# Altium project wired.PrjPcb
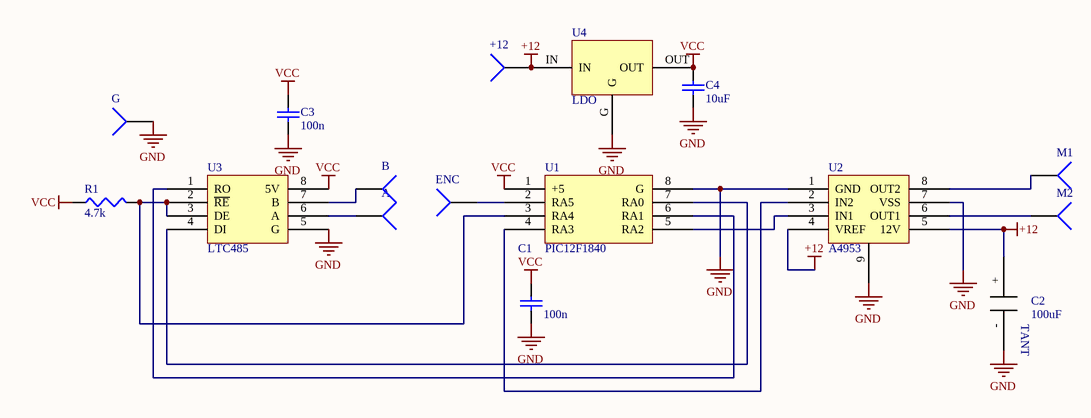
[diagram p0: bluenrg.SchDoc]
1 sheet, 16 parts. Net scope: global (net labels, ports and power ports of the same name join across sheets).
Board file: wired.PcbDoc

## Sheet bluenrg.SchDoc
size A3

### Parts
+12  +12  [MY_PAD]  (value not drawn)
A  A  [MY_PAD]  (value not drawn)
B  B  [MY_PAD]  (value not drawn)
C1  100n  [MY_0603]
C2  100uF  [100uf_tant]
C3  100n  [MY_0603]
C4  10uF  [MY_0805]
ENC  A  [MY_PAD]  (value not drawn)
G  G  [MY_PAD]  (value not drawn)
M1  M1  [MOTOR_18mm]  (value not drawn)
M2  M2  [MOTOR_18mm]  (value not drawn)
R1  4.7k  [MY_0603]
U1  PIC12F1840  [MY_SOIC8N]
U2  A4953  [MY_SOIC8N_TP]
U3  LTC485  [MY_SOIC8N]
U4  LDO  [L78L]

### Nets
+12: +12.1 C2.+ U2.4(VREF) U2.5(12V) U4.IN
GND: C1.1 C2.- C3.1 C4.1 G.1 U1.8(G) U2.1(GND) U2.7(VSS) U2.9 U3.5(G) U4.G
VCC: C1.2 C3.2 C4.2 R1.1 U1.1(+5) U3.8(5V) U4.OUT
NetA_1: A.1 U3.6(A)
NetB_1: B.1 U3.7(B)
NetENC_1: ENC.1 U1.2(RA5)
NetM1_1: M1.1 U2.8(OUT2)
NetM2_1: M2.1 U2.6(OUT1)
NetR1_2: R1.2 U1.3(RA4) U3.2(~{RE}) U3.3(DE)
NetU1_4: U1.4(RA3) U2.2(IN2)
NetU1_5: U1.5(RA2) U2.3(IN1)
NetU1_6: U1.6(RA1) U3.1(RO)
NetU1_7: U1.7(RA0) U3.4(DI)

### Notes on the sheet
- (in symbol C_TANT) TANT

### Library data of the parts
+12 A B ENC G M1 M2 = Socket: LatestRevisionDate: 17-Jul-2002; LatestRevisionNote: Re-released for DXP Platform.; Publisher: Altium Limited
C1 C3 C4 = Cap Semi: Capacitor (Semiconductor SIM Model); Value: 100pF; Published: 8-Jun-2000; LatestRevisionDate: 29-May-2009; LatestRevisionNote: IPC-7351 Footprint Added.; PackageReference: C1206; Publisher: Altium Limited; PackageDescription: Chip Capacitor
C2 = C_TANT
R1 = Res3: Resistor; Value: 1K; Published: 8-Jun-2000; LatestRevisionDate: 29-May-2009; LatestRevisionNote: IPC-7351 Footprint Added.; PackageReference: J1-0603; Publisher: Altium Limited; PackageDescription: Chip Resistor